# EAGLE design ProgrammerBoardV1_1 (EAGLE 8.2.2)
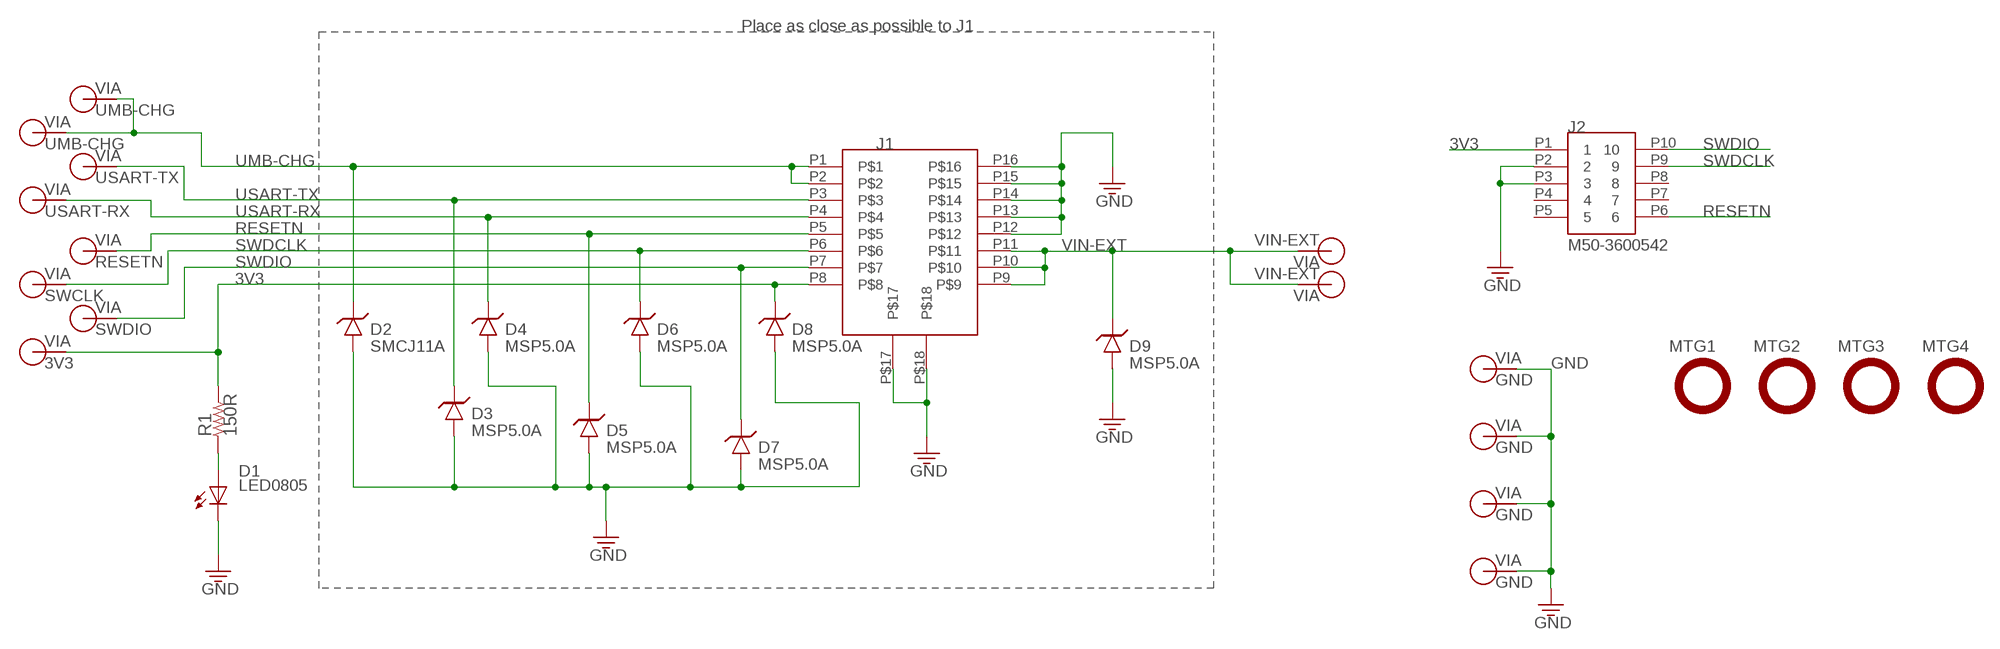
[diagram p0: schematic, sheet 1]

## Parts
D1  LED0805  [0805-D]
D2  SMCJ11A  TVSSMCJ11A  [DO-214AB]
D3  MSP5.0A  TVSMSP  [MICROSMP]
D4  MSP5.0A  TVSMSP  [MICROSMP]
D5  MSP5.0A  TVSMSP  [MICROSMP]
D6  MSP5.0A  TVSMSP  [MICROSMP]
D7  MSP5.0A  TVSMSP  [MICROSMP]
D8  MSP5.0A  TVSMSP  [MICROSMP]
D9  MSP5.0A  TVSMSP  [MICROSMP]
J1  FFC-16REVERSE  [68611614422-REVERSE]
J2  M50-3600542  10PINMALE  [10PINMALE]
MTG1  MTG-NPTH-M2  [M2-NPTH]
MTG2  MTG-NPTH-M2  [M2-NPTH]
MTG3  MTG-NPTH-M2  [M2-NPTH]
MTG4  MTG-NPTH-M2  [M2-NPTH]
R1  150R  RES0805  [0805]
V1  GND  VIA-60MIL  [VIA-60MIL]
V2  GND  VIA-60MIL  [VIA-60MIL]
V3  GND  VIA-60MIL  [VIA-60MIL]
V4  GND  VIA-60MIL  [VIA-60MIL]
V5  SWDIO  VIA-60MIL  [VIA-60MIL]
V6  UMB-CHG  VIA-60MIL  [VIA-60MIL]
V7  UMB-CHG  VIA-60MIL  [VIA-60MIL]
V8  RESETN  VIA-60MIL  [VIA-60MIL]
V9  SWCLK  VIA-60MIL  [VIA-60MIL]
V10  3V3  VIA-60MIL  [VIA-60MIL]
V11  VIN-EXT  VIA-60MIL  [VIA-60MIL]
V12  VIN-EXT  VIA-60MIL  [VIA-60MIL]
V13  USART-RX  VIA-60MIL  [VIA-60MIL]
V14  USART-TX  VIA-60MIL  [VIA-60MIL]

## Nets
3V3: D8.C J1.P8 J2.P1 R1.2 V10.P$1
GND: D1.C D2.A D3.A D4.A D5.A D6.A D7.A D8.A D9.A J1.P12 J1.P13 J1.P14 J1.P15 J1.P16 J1.P$17 J1.P$18 J2.P2 J2.P3 V1.P$1 V2.P$1 V3.P$1 V4.P$1
N$2: D1.A R1.1
RESETN: D5.C J1.P5 J2.P6 V8.P$1
SWDCLK: D6.C J1.P6 J2.P9 V9.P$1
SWDIO: D7.C J1.P7 J2.P10 V5.P$1
UMB-CHG: D2.C J1.P1 J1.P2 V6.P$1 V7.P$1
USART-RX: D4.C J1.P4 V13.P$1
USART-TX: D3.C J1.P3 V14.P$1
VIN-EXT: D9.C J1.P9 J1.P10 J1.P11 V11.P$1 V12.P$1
Unconnected: J2.P4 J2.P5 J2.P7 J2.P8

## Notes on the sheet
- Place as close as possible to J1

## Library data of the parts
D1 = BrownSpaceEngineering:LED
D2-D9 = BrownSpaceEngineering:TVS
J1 = BrownSpaceEngineering:FFC-16
J2 = BrownSpaceEngineering:10PINMALE
MTG1-MTG4 = BrownSpaceEngineering:MTG-NPTH
R1 = BrownSpaceEngineering:RES
V1-V14 = BrownSpaceEngineering:VIA

## Board
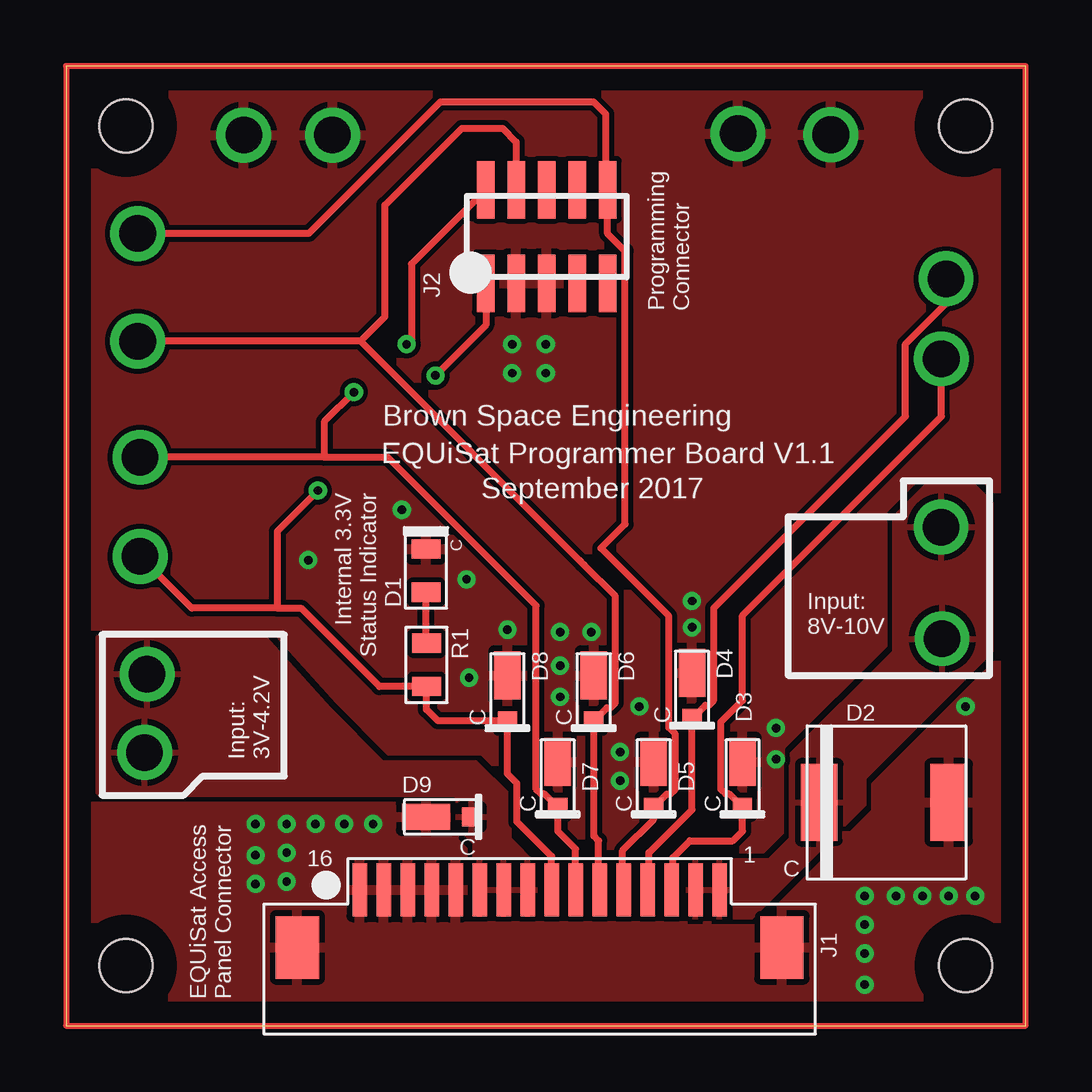
[diagram p1: board, top side]
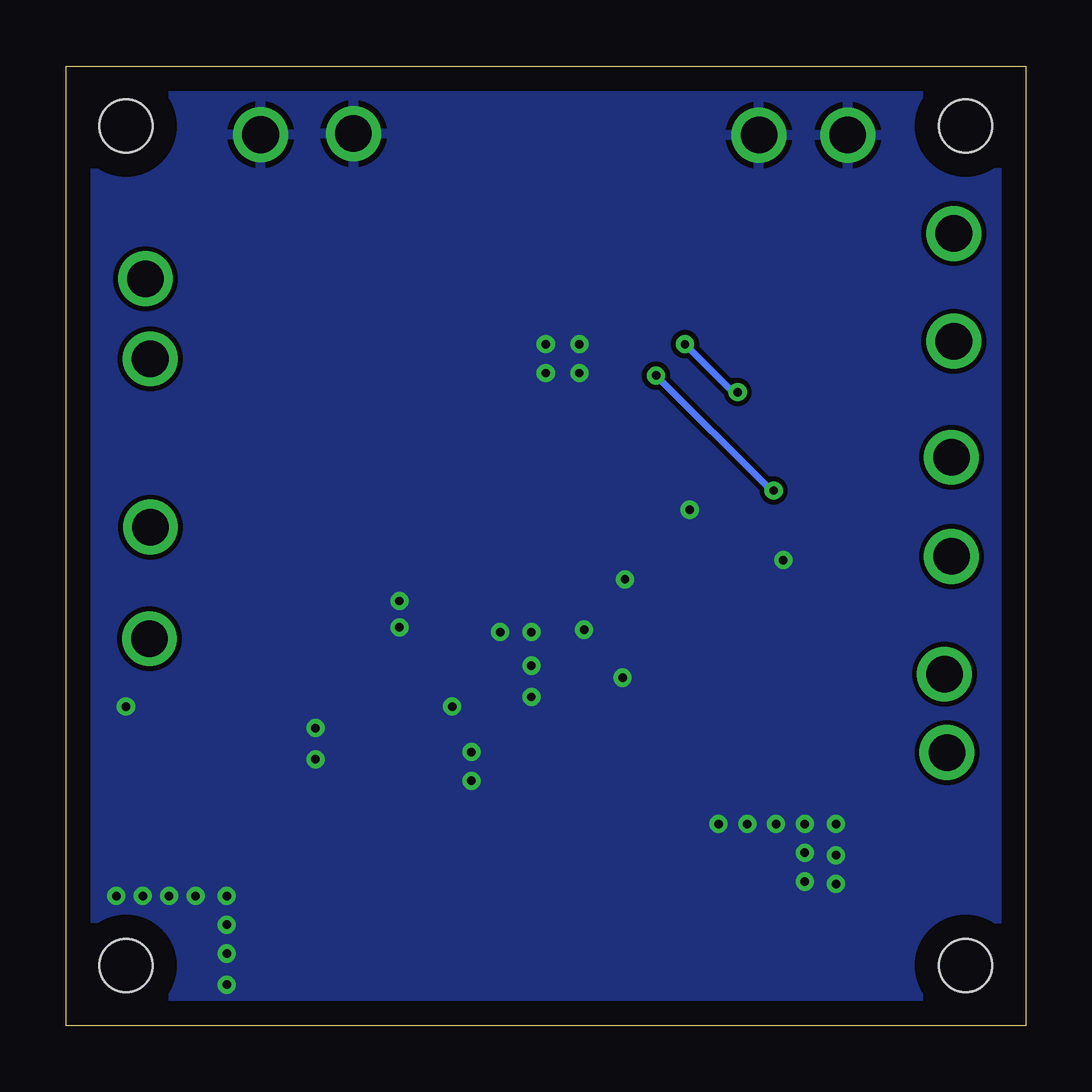
[diagram p2: board, bottom side, seen from below]

Size 40 x 40 mm. Coordinates in mm from the lower left corner, seen from the top.
Outline: 0,0 40,0 40,40 0,40 0,0
Copper layers (1*16): Top 0.035mm / dielectric 1.5mm / Bottom 0.035mm
Design rules "default": minimum track width 10mil, minimum drill 24mil, track to track 8mil, track to pad 8mil, pad to pad 8mil, via to via 8mil, smd to smd 8mil, copper to edge 40mil, drill to drill 8mil, minimum pad ring 10mil, minimum via ring 8mil, stop-mask expansion 4mil, vias tented up to drill 0mil, thermal gap 10mil

### Footprints (pad centres in the part's own frame; a part is rotated, then mirrored left to right if it is on the bottom)
0805-D = smd 0.8 x 1.2: A -0.9,0; C 0.9,0
DO-214AB = smd 1.52 x 3.2: A 5.4,0; C 0,0
MICROSMP = smd 2 x 1.1: A -1.3,0 | smd 0.8 x 0.8: C 0.6,0
68611614422-REVERSE = smd 0.6 x 2.2: P1 15,0; P2 14,0; P3 13,0; P4 12,0; P5 11,0; P6 10,0; P7 9,0; P8 8,0; P9 7,0; P10 6,0; P11 5,0; P12 4,0; P13 3,0; P14 2,0; P15 1,0; P16 0,0 | smd 1.8 x 2.6: P$17 17.6,-2.4; P$18 -2.6,-2.4
10PINMALE = smd 0.74 x 2.4: P1 -2.54,-1.95; P2 -1.27,-1.95; P3 0,-1.95; P4 1.27,-1.95; P5 2.54,-1.95; P6 2.54,1.95; P7 1.27,1.95; P8 0,1.95; P9 -1.27,1.95; P10 -2.54,1.95
M2-NPTH = hole 2.2: 0,0
0805 = smd 0.8 x 1.2: 1 -0.9,0; 2 0.9,0
VIA-60MIL = drill 1.524: P$1 0,0

### Placement (x,y rotation side)
D1  15.01,18.97 90 top
D2  31.4,9.3 0 top
D3  28.2,9.7 270 top
D4  26.1,13.4 270 top
D5  24.5,9.7 270 top
D6  22,13.3 270 top
D7  20.5,9.7 270 top
D8  18.4,13.3 270 top
D9  16.3,8.7 0 top
J1  12.24,5.66 0 top
J2  20.04,32.89 0 top
MTG1  2.5,2.5 0 top
MTG2  37.5,2.5 0 top
MTG3  2.5,37.5 0 top
MTG4  37.5,37.5 0 top
R1  15.03,15.03 270 top
V1  11.11,37.12 270 top
V2  28.02,37.18 180 top
V3  7.41,37.12 0 top
V4  31.88,37.13 0 top
V5  3.09,23.69 180 top
V6  36.52,16.12 180 top
V7  36.48,20.78 90 top
V8  2.99,33.02 180 top
V9  2.99,28.52 180 top
V10  3.09,19.55 180 top
V11  3.38,14.65 0 top
V12  3.28,11.38 0 top
V13  36.69,31.13 180 top
V14  36.49,27.79 180 top

### Tracks (layer width: path | path; a pad name or v marks a point on that pad's centre or on a via)
3V3  (via drill 0.35)
  Top 0.3: J1.P8 20.24,7.06 18.8,8.5 18.8,10.1 18.4,10.5 D8.C 15.5,12.7 15.03,13.17 R1.2 13.07,14.13 9.8,17.4 8.8,17.4 | 8.8,17.4 5.24,17.4 V10.P$1 | J2.P1 17.5,29.2 15.5,27.2 15.5,27.1 v15.4,27.1 | v10.5,22.3 8.8,20.6 8.8,17.4
  Bottom 0.3: v15.4,27.1 10.7,22.4 10.6,22.4 v10.5,22.3
GND  (via drill 0.35)
  other vias: 34.6,5.4 35.7,5.4 36.8,5.4 37.9,5.4 37.5,13.3 9.2,6 9.2,7.2 9.2,8.4 10.4,8.4 11.6,8.4 12.8,8.4 23.9,13.3 20.6,13.7 18.4,16.5 21.9,16.4 26.1,16.6 29.6,11.1 20.6,15 20.6,16.4 23.1,10.2 23.1,11.4 26.1,17.7 29.6,12.4 16.8,14.5 14,21.5 16.7,18.6 10.1,19.4 18.6,28.4 20,28.4 20,27.2 18.6,27.2 33.3,5.4 33.3,4.2 33.3,3 33.3,1.7 7.9,5.9 7.9,7.1 7.9,8.4
  pour Bottom: -1.57,54.72 -1.27,-1.27 42.26,-1.07 41.96,54.92
  pour Top (rank 4): -3.41,56.83 47.2,57.43 46.8,-4.48 -3.81,-5.08
N$1
  Top 0.25: 0,0 40,0 40,40 0,40 0,0
N$2
  Top 0.3: R1.1 15.01,15.95 D1.A
RESETN
  Top 0.3: J1.P5 23.2,5.7 23.2,7.3 24.5,8.6 D5.C 25.05,9.65 25.2,9.65 25.4,9.85 25.4,12.15 25.13,12.42 25.13,17.07 22.3,19.9 23.3,20.9 23.3,32.29 22.58,33.01 J2.P6 22.5,34.92 22.5,38 22,38.5 15.6,38.5 10.12,33.02 V8.P$1
SWDCLK
  Top 0.3: J1.P6 22.2,5.7 22.2,7.7 22,7.9 D6.C 22.55,13.25 22.7,13.25 22.9,13.45 22.9,17.9 21.6,19.2 | 21.6,19.2 21.4,19.4 | 21.6,19.2 12.28,28.52 | 12.28,28.52 V9.P$1 | 12.28,28.52 13.3,29.55 13.3,34.2 16.5,37.4 18.2,37.4 18.77,36.83 J2.P9
SWDIO  (via drill 0.35)
  Top 0.3: J1.P7 21.24,7.36 20.5,8.1 D7.C 19.95,9.65 19.8,9.65 19.6,9.85 19.6,17.5 13.41,23.69 10.77,23.69 | 10.77,23.69 V5.P$1 | J2.P10 14.4,31.74 14.4,28.6 v14.2,28.4 | v12,26.4 10.77,25.17 10.77,23.69
  Bottom 0.3: v14.2,28.4 12.2,26.4 v12,26.4
UMB-CHG
  pour Top: 25.9,6.7 26.1,6.9 29.3,6.9 30.2,7.8 30.2,11.3 34.5,15.6 34.5,21.2 35.8,22.5 37.9,22.5 38.6,21.8 38.6,15.6 33.3,10.3 33.3,9.2 28.6,4.5 25.9,4.5
USART-RX
  Top 0.3: J1.P4 24.3,5.71 24.3,7.2 26.1,9 D4.C 26.65,13.35 26.8,13.35 27,13.55 27,17.4 34.99,25.39 34.99,28.41 36.69,30.11 V13.P$1
USART-TX
  Top 0.3: J1.P3 25.3,5.71 25.3,7 26,7.7 27.8,7.7 28.2,8.1 D3.C 27.65,9.65 27.5,9.65 27.3,9.85 27.3,12.65 28.2,13.55 28.2,17.1 29.9,18.8 | 29.9,18.8 30,18.9 | 29.9,18.8 36.49,25.39 V14.P$1
VIN-EXT
  pour Top: 17,4.6 19.6,4.6 19.6,6.7 18.5,7.8 18.5,9.6 17.1,11 13.2,11 11,13.2 8.3,16.2 1.3,16.2 1.3,9.7 1.4,9.6 16.2,9.6 16.3,9.5 16.3,8.3 17,7.6

### Text on the board
tNames: Programming / Connector | Brown Space Engineering | EQUiSat Programmer Board V1.1 | Internal 3.3V / Status Indicator | September 2017 | Input: / 8V-10V | Input: / 3V-4.2V | EQUiSat Access / Panel Connector